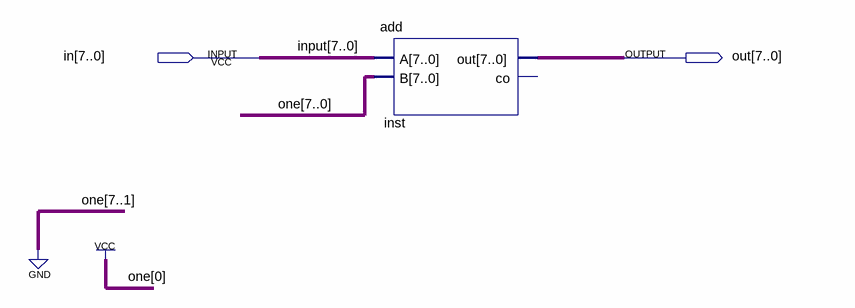
[diagram p0: schematic sheet]
// Quartus schematic sum1.bdf as structural Verilog: 1 symbols, 2 pins
module sum1 (
  input  [7:0] in,
  output [7:0] out
);

  add inst (.A(in), .B(8'b00000001), .out(out));  // open: co

  // Other names for the same wires on the sheet: input[7:0] = in
endmodule
